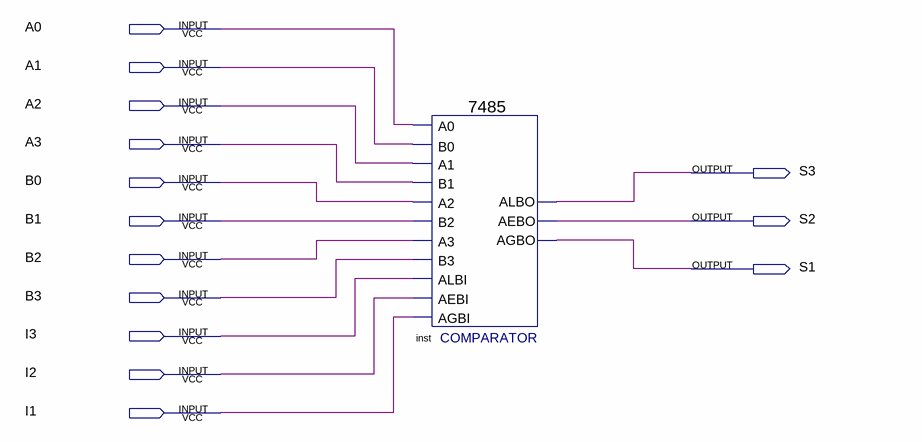
[diagram p0: schematic sheet]
// Quartus schematic circuitoFigura4.bdf as structural Verilog: 1 symbols, 14 pins
module circuitoFigura4 (
  input  A0,
  input  A1,
  input  A2,
  input  A3,
  input  B0,
  input  B1,
  input  B2,
  input  B3,
  input  I3,
  input  I2,
  input  I1,
  output S3,
  output S2,
  output S1
);

  \7485  inst (
    .A3(B2), .B2(B1), .A2(B0), .AEBI(I2), .AGBI(I1), .ALBI(I3), .A0(A0), .B0(A1), .B3(B3), .A1(A2), .B1(A3),
    .ALBO(S3), .AGBO(S1), .AEBO(S2));
endmodule
